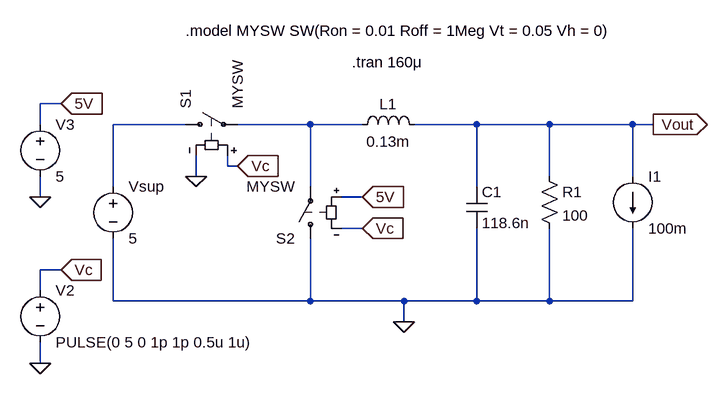
[diagram p0: schematic Q1.asc]
Q1.asc, the LTspice schematic file:
Version 4
SHEET 1 996 680
WIRE -16 176 -48 176
WIRE -48 208 -48 176
WIRE 176 208 64 208
WIRE 368 208 256 208
WIRE 448 208 368 208
WIRE 624 208 528 208
WIRE 736 208 624 208
WIRE 864 208 736 208
WIRE 896 208 864 208
WIRE 240 272 240 256
WIRE 256 272 240 272
WIRE 192 288 192 256
WIRE 736 288 736 208
WIRE 864 288 864 208
WIRE 64 304 64 208
WIRE 368 304 368 208
WIRE 624 304 624 208
WIRE -48 320 -48 288
WIRE 448 320 416 320
WIRE 448 368 416 368
WIRE -16 432 -48 432
WIRE -48 464 -48 432
WIRE 64 480 64 384
WIRE 368 480 368 384
WIRE 368 480 64 480
WIRE 512 480 368 480
WIRE 624 480 624 368
WIRE 624 480 512 480
WIRE 736 480 736 368
WIRE 736 480 624 480
WIRE 864 480 864 368
WIRE 864 480 736 480
WIRE 512 512 512 480
WIRE -48 576 -48 544
FLAG 512 512 0
FLAG 192 288 0
FLAG -48 576 0
FLAG -16 432 Vc
IOPIN -16 432 In
FLAG 256 272 Vc
IOPIN 256 272 In
FLAG 448 368 Vc
IOPIN 448 368 In
FLAG -48 320 0
FLAG -16 176 5V
IOPIN -16 176 In
FLAG 448 320 5V
IOPIN 448 320 In
FLAG 896 208 Vout
IOPIN 896 208 Out
SYMBOL ind 432 224 R270
WINDOW 0 32 56 VTop 2
WINDOW 3 5 56 VBottom 2
SYMATTR InstName L1
SYMATTR Value 0.13m
SYMBOL cap 608 304 R0
SYMATTR InstName C1
SYMATTR Value 118.6n
SYMBOL res 720 272 R0
SYMATTR InstName R1
SYMATTR Value 100
SYMBOL current 864 288 R0
SYMATTR InstName I1
SYMATTR Value 100m
SYMBOL voltage 64 288 R0
SYMATTR InstName Vsup
SYMATTR Value 5
SYMBOL sw 160 208 R270
SYMATTR InstName S1
SYMATTR Value MYSW
SYMBOL sw 368 400 R180
SYMATTR InstName S2
SYMATTR Value MYSW
SYMBOL voltage -48 448 R0
SYMATTR InstName V2
SYMATTR Value PULSE(0 5 0 1p 1p 0.5u 1u)
SYMBOL voltage -48 192 R0
SYMATTR InstName V3
SYMATTR Value 5
TEXT 176 64 Left 2 !.model MYSW SW(Ron = 0.01 Roff = 1Meg Vt = 0.05 Vh = 0)
TEXT 432 112 Left 2 !.tran 160μ

The netlist it stands for:
* Q1.asc
L1 N002 Vout 0.13m
C1 Vout 0 118.6n
R1 Vout 0 100
I1 Vout 0 100m
Vsup N001 0 5
S1 N001 N002 Vc 0 MYSW
S2 0 N002 5V Vc MYSW
V2 Vc 0 PULSE(0 5 0 1p 1p 0.5u 1u)
V3 5V 0 5
.model MYSW SW(Ron = 0.01 Roff = 1Meg Vt = 0.05 Vh = 0)
.tran 160μ
.backanno
.end